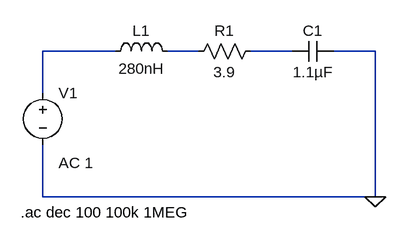
[diagram p0: schematic load-ac-sweep.asc]
load-ac-sweep.asc, the LTspice schematic file:
Version 4
SHEET 1 880 680
WIRE 64 96 -48 96
WIRE 192 96 144 96
WIRE 336 96 272 96
WIRE 464 96 400 96
WIRE -48 160 -48 96
WIRE -48 320 -48 240
WIRE 464 320 464 96
WIRE 464 320 -48 320
FLAG 464 320 0
SYMBOL res 176 112 R270
WINDOW 0 32 56 VTop 2
WINDOW 3 0 56 VBottom 2
SYMATTR InstName R1
SYMATTR Value 3.9
SYMBOL ind 48 112 R270
WINDOW 0 32 56 VTop 2
WINDOW 3 5 56 VBottom 2
SYMATTR InstName L1
SYMATTR Value 280nH
SYMBOL cap 336 112 R270
WINDOW 0 32 32 VTop 2
WINDOW 3 0 32 VBottom 2
SYMATTR InstName C1
SYMATTR Value 1.1µF
SYMBOL voltage -48 144 R0
WINDOW 123 24 124 Left 2
WINDOW 39 0 0 Left 0
SYMATTR InstName V1
SYMATTR Value ""
SYMATTR Value2 AC 1
TEXT -82 344 Left 2 !.ac dec 100 100k 1MEG

The netlist it stands for:
* load-ac-sweep.asc
R1 N002 N003 3.9
L1 N001 N002 280nH
C1 N003 0 1.1µF
V1 N001 0 AC 1
.ac dec 100 100k 1MEG
.backanno
.end